# Altium schematic sheet DAC_FMC_connector.SchDoc: FMC DAC 1.5GS 4CH
size 420 x 297 mm; Author: G.Kasprowicz; CompanyName: WUT ISE; DrawnBy: G.Kasprowicz; Organization: WUT ISE; Address1: PW ISE; Address2: Nowowiejska 15/19 00-665 Warsaw; Address3: gkasprow@gmail.com; Revision: 1; SheetNumber: -; SheetTotal: -; ModifiedBy: -; CheckedDate: -; Title2: FMC; DivGrp: WUT ISE; Designer: G.Kasprowicz; ModifiedDate: -; ProjectName: Sensor Box
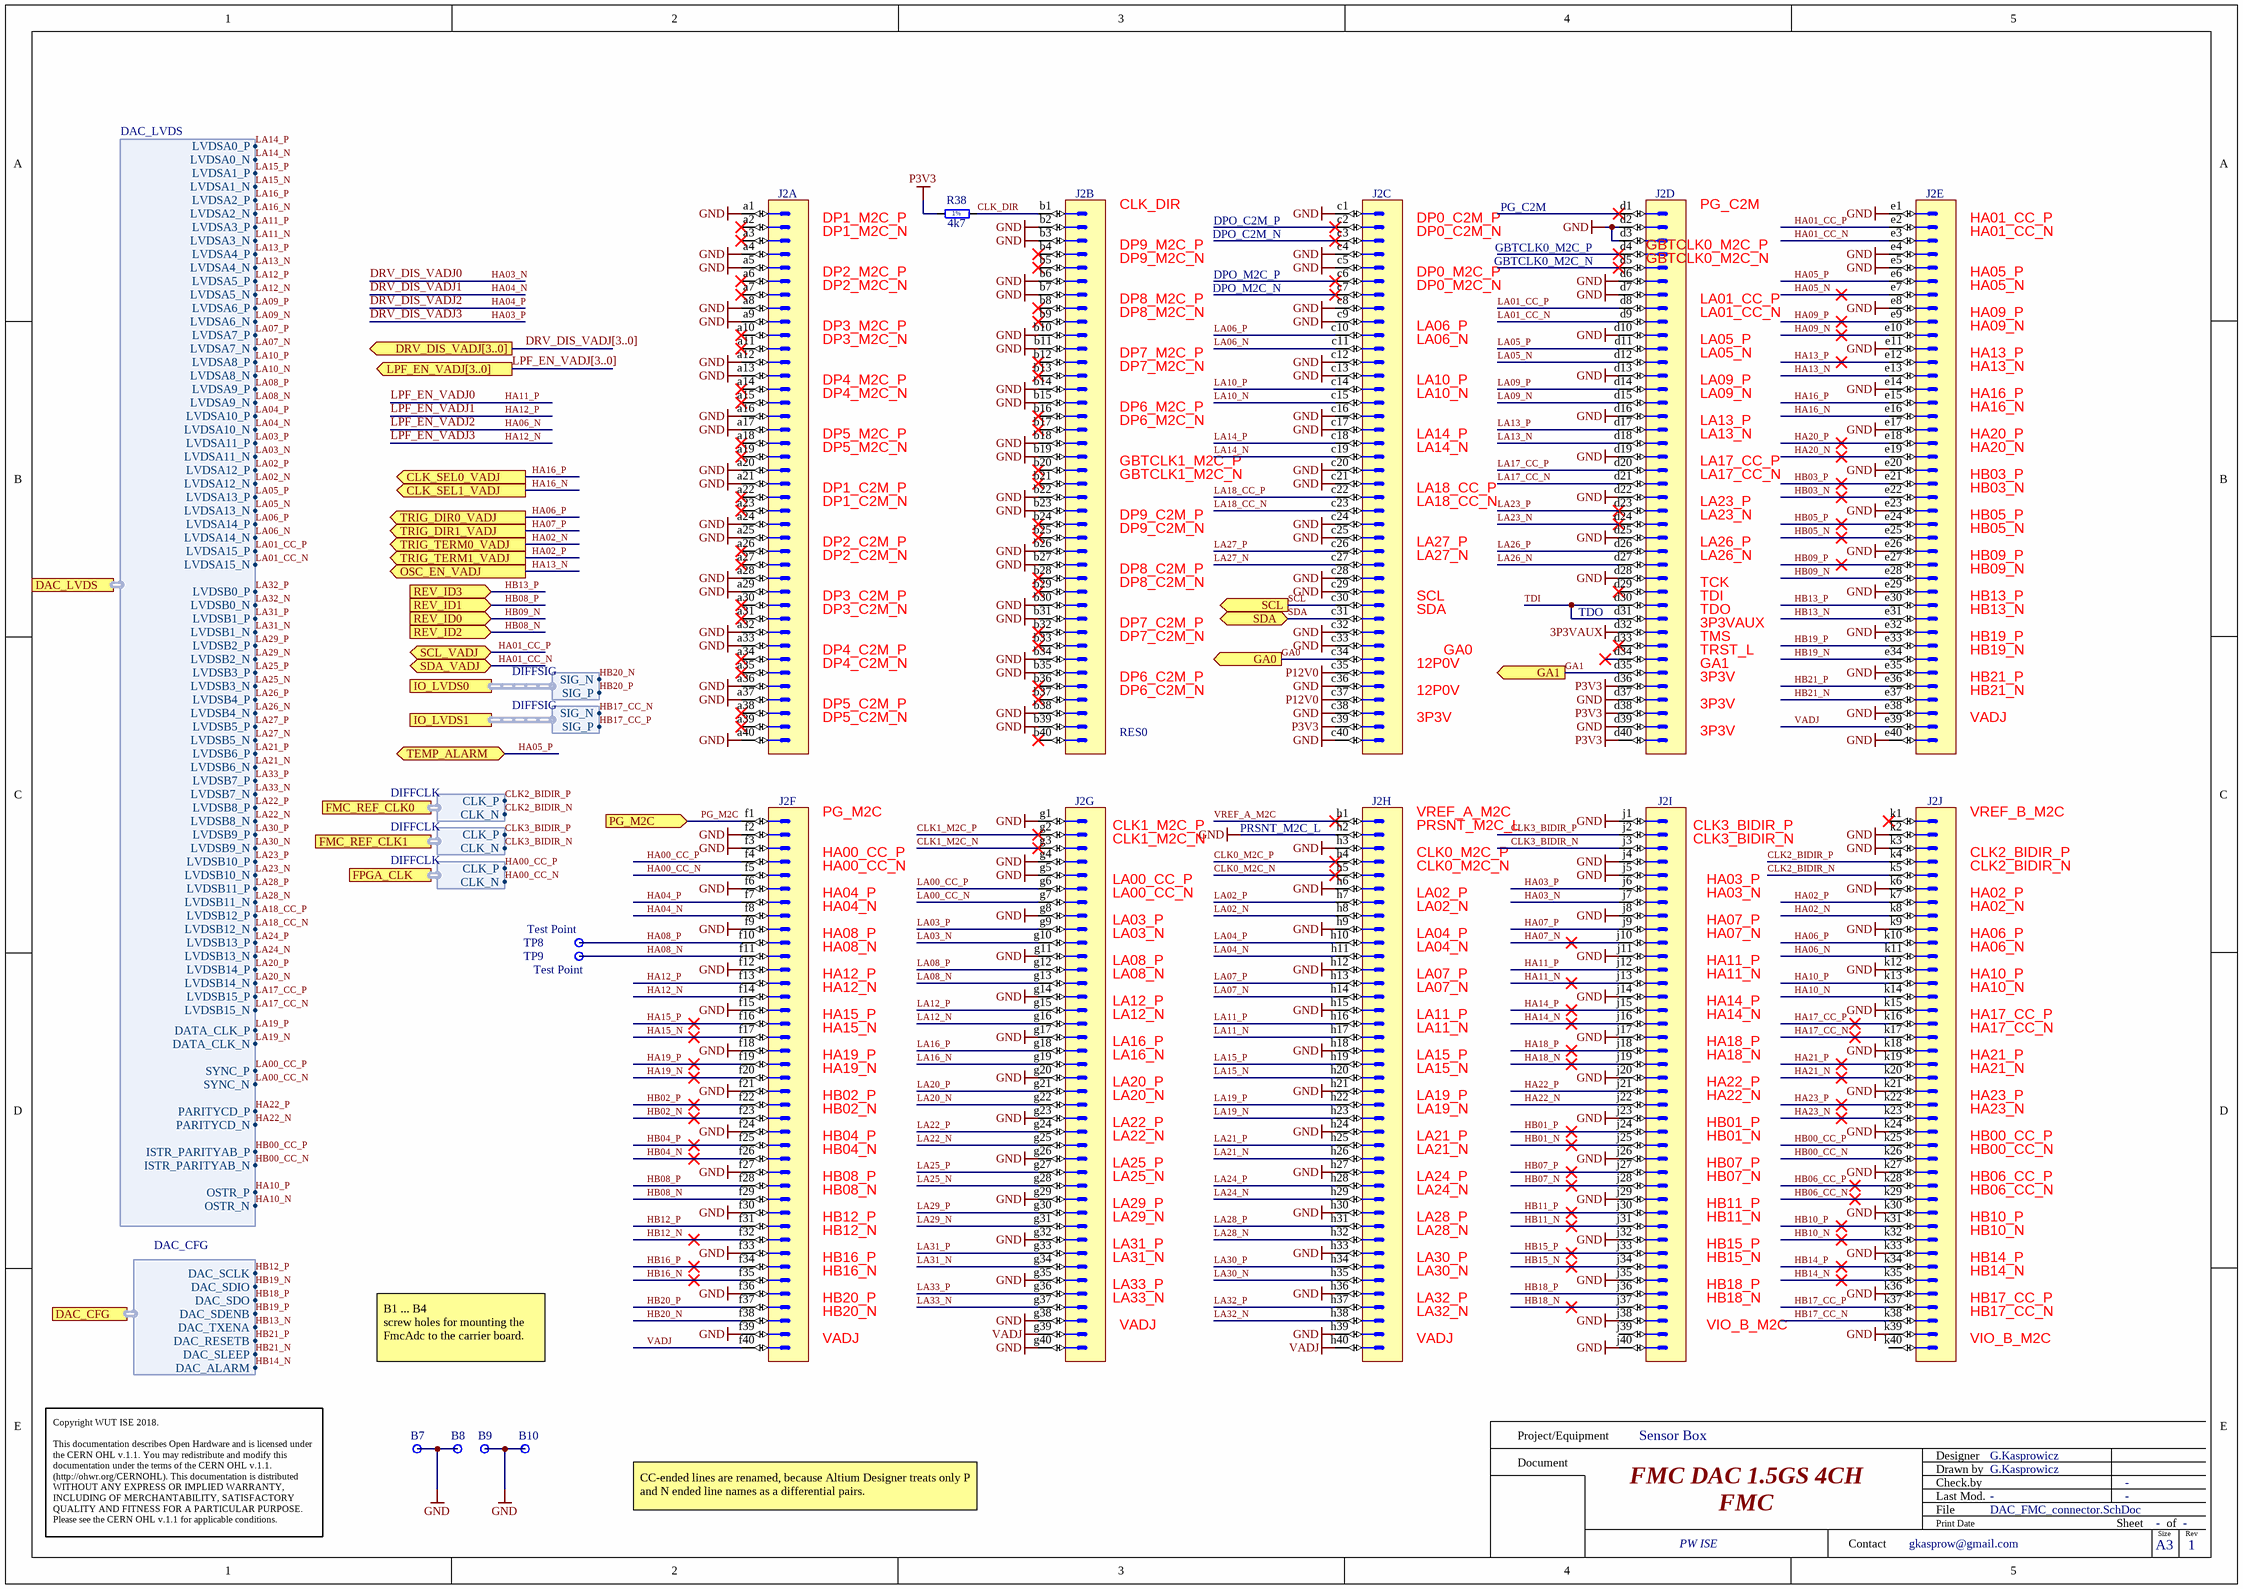
[diagram p0: DAC_FMC_connector.SchDoc]

## Parts
B7  Plated Hole  [MTG300_600]  (value not drawn)  (no BOM)
B8  Plated Hole  [MTG300_600]  (value not drawn)  (no BOM)
B9  Plated Hole  [MTG300_600]  (value not drawn)  (no BOM)
B10  Plated Hole  [MTG300_600]  (value not drawn)  (no BOM)
J2  VITA 57  [SAMTEC_ASP-134488-01]  (value not drawn)  (parts A,B,C,D,E,F,G,H,I,J of 10)
R38  4k7  [RESC1608X55N]
TP8  Test Point  [TPS127]  (no BOM)
TP9  Test Point  [TPS127]  (no BOM)

## Ports
CLK_SEL0_VADJ (out), CLK_SEL1_VADJ (out), DAC_CFG (harness DAC_CFG), DAC_LVDS (harness DAC_LVDS), DRV_DIS_VADJ[3..0] (out), FMC_REF_CLK0 (harness DIFFCLK), FMC_REF_CLK1 (harness DIFFCLK), FPGA_CLK (harness DIFFCLK), GA0 (out), GA1 (out), IO_LVDS0 (harness DIFFSIG), IO_LVDS1 (harness DIFFSIG), LPF_EN_VADJ[3..0] (out), OSC_EN_VADJ (out), PG_M2C (in), REV_ID0 (in), REV_ID1 (in), REV_ID2 (in), REV_ID3 (in), SCL (out), SCL_VADJ (bidir), SDA (bidir), SDA_VADJ (bidir), TEMP_ALARM (bidir), TRIG_DIR0_VADJ (out), TRIG_DIR1_VADJ (out), TRIG_TERM0_VADJ (out), TRIG_TERM1_VADJ (out)

## Harnesses
DAC_LVDS: LVDSA0_P, LVDSA0_N, LVDSA1_P, LVDSA1_N, LVDSA2_P, LVDSA2_N, LVDSA3_P, LVDSA3_N, LVDSA4_P, LVDSA4_N, LVDSA5_P, LVDSA5_N, LVDSA6_P, LVDSA6_N, LVDSA7_P, LVDSA7_N, LVDSA8_P, LVDSA8_N, LVDSA9_P, LVDSA9_N, LVDSA10_P, LVDSA10_N, LVDSA11_P, LVDSA11_N, LVDSA12_P, LVDSA12_N, LVDSA13_P, LVDSA13_N, LVDSA14_P, LVDSA14_N, LVDSA15_P, LVDSA15_N, LVDSB0_P, LVDSB0_N, LVDSB1_P, LVDSB1_N, LVDSB2_P, LVDSB2_N, LVDSB3_P, LVDSB3_N, LVDSB4_P, LVDSB4_N, LVDSB5_P, LVDSB5_N, LVDSB6_P, LVDSB6_N, LVDSB7_P, LVDSB7_N, LVDSB8_P, LVDSB8_N, LVDSB9_P, LVDSB9_N, LVDSB10_P, LVDSB10_N, LVDSB11_P, LVDSB11_N, LVDSB12_P, LVDSB12_N, LVDSB13_P, LVDSB13_N, LVDSB14_P, LVDSB14_N, LVDSB15_P, LVDSB15_N, DATA_CLK_P, DATA_CLK_N, SYNC_P, SYNC_N, PARITYCD_P, PARITYCD_N, ISTR_PARITYAB_P, ISTR_PARITYAB_N, OSTR_P, OSTR_N
DAC_CFG: DAC_SCLK, DAC_SDIO, DAC_SDO, DAC_SDENB, DAC_TXENA, DAC_RESETB, DAC_SLEEP, DAC_ALARM
DIFFCLK: CLK_P, CLK_N
DIFFSIG: SIG_N, SIG_P

## Nets
3P3VAUX: J2.d32
GND: B7.1 B8.1 B9.1 B10.1 J2.a1 J2.a4 J2.a5 J2.a8 J2.a9 J2.a12 J2.a13 J2.a16 J2.a17 J2.a20 J2.a21 J2.a24 J2.a25 J2.a28 J2.a29 J2.a32 J2.a33 J2.a36 J2.a37 J2.a40 J2.b2 J2.b3 J2.b6 J2.b7 J2.b10 J2.b11 J2.b14 J2.b15 J2.b18 J2.b19 J2.b22 J2.b23 J2.b26 J2.b27 J2.b30 J2.b31 J2.b34 J2.b35 J2.b38 J2.b39 J2.c1 J2.c4 J2.c5 J2.c8 J2.c9 J2.c12 J2.c13 J2.c16 J2.c17 J2.c20 J2.c21 J2.c24 J2.c25 J2.c28 J2.c29 J2.c32 J2.c33 J2.c36 J2.c38 J2.c40 J2.d2 J2.d3 J2.d6 J2.d7 J2.d10 J2.d13 J2.d16 J2.d19 J2.d22 J2.d25 J2.d28 J2.d37 J2.d39 J2.e1 J2.e4 J2.e5 J2.e8 J2.e11 J2.e14 J2.e17 J2.e20 J2.e23 J2.e26 J2.e29 J2.e32 J2.e35 J2.e38 J2.e40 J2.f2 J2.f3 J2.f6 J2.f9 J2.f12 J2.f15 J2.f18 J2.f21 J2.f24 J2.f27 J2.f30 J2.f33 J2.f36 J2.f39 J2.g1 J2.g4 J2.g5 J2.g8 J2.g11 J2.g14 J2.g17 J2.g20 J2.g23 J2.g26 J2.g29 J2.g32 J2.g35 J2.g38 J2.g40 J2.h2 J2.h3 J2.h6 J2.h9 J2.h12 J2.h15 J2.h18 J2.h21 J2.h24 J2.h27 J2.h30 J2.h33 J2.h36 J2.h39 J2.j1 J2.j4 J2.j5 J2.j8 J2.j11 J2.j14 J2.j17 J2.j20 J2.j23 J2.j26 J2.j29 J2.j32 J2.j35 J2.j38 J2.j40 J2.k2 J2.k3 J2.k6 J2.k9 J2.k12 J2.k15 J2.k18 J2.k21 J2.k24 J2.k27 J2.k30 J2.k33 J2.k36 J2.k39
P3V3: J2.c39 J2.d36 J2.d38 J2.d40 R38.1
P12V0: J2.c35 J2.c37
VADJ: J2.e39 J2.f40 J2.g39 J2.h40
CLK0_M2C_N: J2.h5
CLK0_M2C_P: J2.h4
CLK1_M2C_N: J2.g3
CLK1_M2C_P: J2.g2
CLK2_BIDIR_N: J2.k5 ; port FMC_REF_CLK0.CLK_N
CLK2_BIDIR_P: J2.k4 ; port FMC_REF_CLK0.CLK_P
CLK3_BIDIR_N: J2.j3 ; port FMC_REF_CLK1.CLK_N
CLK3_BIDIR_P: J2.j2 ; port FMC_REF_CLK1.CLK_P
CLK_DIR: J2.b1 R38.2
DRV_DIS_VADJ0: J2.j7  [also labelled HA03_N]
DRV_DIS_VADJ1: J2.f8  [also labelled HA04_N]
DRV_DIS_VADJ2: J2.f7  [also labelled HA04_P]
DRV_DIS_VADJ3: J2.j6  [also labelled HA03_P]
GA0: J2.c34 ; port GA0
GA1: J2.d35 ; port GA1
HA00_CC_N: J2.f5 ; port FPGA_CLK.CLK_N
HA00_CC_P: J2.f4 ; port FPGA_CLK.CLK_P
HA01_CC_N: J2.e3 ; port SDA_VADJ
HA01_CC_P: J2.e2 ; port SCL_VADJ
HA02_N: J2.k8 ; port TRIG_TERM0_VADJ
HA02_P: J2.k7 ; port TRIG_TERM1_VADJ
HA05_N: J2.e7
HA05_P: J2.e6 ; port TEMP_ALARM
HA06_N: J2.k11  [also labelled LPF_EN_VADJ2]
HA06_P: J2.k10 ; port TRIG_DIR0_VADJ
HA07_N: J2.j10
HA07_P: J2.j9 ; port TRIG_DIR1_VADJ
HA08_N: J2.f11 TP9.1
HA08_P: J2.f10 TP8.1
HA09_N: J2.e10
HA09_P: J2.e9
HA10_N: J2.k14 ; port DAC_LVDS.OSTR_N
HA10_P: J2.k13 ; port DAC_LVDS.OSTR_P
HA11_N: J2.j13
HA11_P: J2.j12  [also labelled LPF_EN_VADJ0]
HA12_N: J2.f14  [also labelled LPF_EN_VADJ3]
HA12_P: J2.f13  [also labelled LPF_EN_VADJ1]
HA13_N: J2.e13 ; port OSC_EN_VADJ
HA13_P: J2.e12
HA14_N: J2.j16
HA14_P: J2.j15
HA15_N: J2.f17
HA15_P: J2.f16
HA16_N: J2.e16 ; port CLK_SEL1_VADJ
HA16_P: J2.e15 ; port CLK_SEL0_VADJ
HA17_CC_N: J2.k17
HA17_CC_P: J2.k16
HA18_N: J2.j19
HA18_P: J2.j18
HA19_N: J2.f20
HA19_P: J2.f19
HA20_N: J2.e19
HA20_P: J2.e18
HA21_N: J2.k20
HA21_P: J2.k19
HA22_N: J2.j22 ; port DAC_LVDS.PARITYCD_N
HA22_P: J2.j21 ; port DAC_LVDS.PARITYCD_P
HA23_N: J2.k23
HA23_P: J2.k22
HB00_CC_N: J2.k26 ; port DAC_LVDS.ISTR_PARITYAB_N
HB00_CC_P: J2.k25 ; port DAC_LVDS.ISTR_PARITYAB_P
HB01_N: J2.j25
HB01_P: J2.j24
HB02_N: J2.f23
HB02_P: J2.f22
HB03_N: J2.e22
HB03_P: J2.e21
HB04_N: J2.f26
HB04_P: J2.f25
HB05_N: J2.e25
HB05_P: J2.e24
HB06_CC_N: J2.k29
HB06_CC_P: J2.k28
HB07_N: J2.j28
HB07_P: J2.j27
HB08_N: J2.f29 ; port REV_ID2
HB08_P: J2.f28 ; port REV_ID1
HB09_N: J2.e28 ; port REV_ID0
HB09_P: J2.e27
HB10_N: J2.k32
HB10_P: J2.k31
HB11_N: J2.j31
HB11_P: J2.j30
HB12_N: J2.f32
HB12_P: J2.f31 ; port DAC_CFG.DAC_SCLK
HB13_N: J2.e31 ; port DAC_CFG.DAC_TXENA
HB13_P: J2.e30 ; port REV_ID3
HB14_N: J2.k35 ; port DAC_CFG.DAC_ALARM
HB14_P: J2.k34
HB15_N: J2.j34
HB15_P: J2.j33
HB16_N: J2.f35
HB16_P: J2.f34
HB17_CC_N: J2.k38 ; port IO_LVDS1.SIG_N
HB17_CC_P: J2.k37 ; port IO_LVDS1.SIG_P
HB18_N: J2.j37
HB18_P: J2.j36 ; port DAC_CFG.DAC_SDO
HB19_N: J2.e34 ; port DAC_CFG.DAC_SDIO
HB19_P: J2.e33 ; port DAC_CFG.DAC_SDENB
HB20_N: J2.f38 ; port IO_LVDS0.SIG_N
HB20_P: J2.f37 ; port IO_LVDS0.SIG_P
HB21_N: J2.e37 ; port DAC_CFG.DAC_SLEEP
HB21_P: J2.e36 ; port DAC_CFG.DAC_RESETB
LA00_CC_N: J2.g7 ; port DAC_LVDS.SYNC_N
LA00_CC_P: J2.g6 ; port DAC_LVDS.SYNC_P
LA01_CC_N: J2.d9 ; port DAC_LVDS.LVDSA15_N
LA01_CC_P: J2.d8 ; port DAC_LVDS.LVDSA15_P
LA02_N: J2.h8 ; port DAC_LVDS.LVDSA12_N
LA02_P: J2.h7 ; port DAC_LVDS.LVDSA12_P
LA03_N: J2.g10 ; port DAC_LVDS.LVDSA11_N
LA03_P: J2.g9 ; port DAC_LVDS.LVDSA11_P
LA04_N: J2.h11 ; port DAC_LVDS.LVDSA10_N
LA04_P: J2.h10 ; port DAC_LVDS.LVDSA10_P
LA05_N: J2.d12 ; port DAC_LVDS.LVDSA13_N
LA05_P: J2.d11 ; port DAC_LVDS.LVDSA13_P
LA06_N: J2.c11 ; port DAC_LVDS.LVDSA14_N
LA06_P: J2.c10 ; port DAC_LVDS.LVDSA14_P
LA07_N: J2.h14 ; port DAC_LVDS.LVDSA7_N
LA07_P: J2.h13 ; port DAC_LVDS.LVDSA7_P
LA08_N: J2.g13 ; port DAC_LVDS.LVDSA9_N
LA08_P: J2.g12 ; port DAC_LVDS.LVDSA9_P
LA09_N: J2.d15 ; port DAC_LVDS.LVDSA6_N
LA09_P: J2.d14 ; port DAC_LVDS.LVDSA6_P
LA10_N: J2.c15 ; port DAC_LVDS.LVDSA8_N
LA10_P: J2.c14 ; port DAC_LVDS.LVDSA8_P
LA11_N: J2.h17 ; port DAC_LVDS.LVDSA3_N
LA11_P: J2.h16 ; port DAC_LVDS.LVDSA3_P
LA12_N: J2.g16 ; port DAC_LVDS.LVDSA5_N
LA12_P: J2.g15 ; port DAC_LVDS.LVDSA5_P
LA13_N: J2.d18 ; port DAC_LVDS.LVDSA4_N
LA13_P: J2.d17 ; port DAC_LVDS.LVDSA4_P
LA14_N: J2.c19 ; port DAC_LVDS.LVDSA0_N
LA14_P: J2.c18 ; port DAC_LVDS.LVDSA0_P
LA15_N: J2.h20 ; port DAC_LVDS.LVDSA1_N
LA15_P: J2.h19 ; port DAC_LVDS.LVDSA1_P
LA16_N: J2.g19 ; port DAC_LVDS.LVDSA2_N
LA16_P: J2.g18 ; port DAC_LVDS.LVDSA2_P
LA17_CC_N: J2.d21 ; port DAC_LVDS.LVDSB15_N
LA17_CC_P: J2.d20 ; port DAC_LVDS.LVDSB15_P
LA18_CC_N: J2.c23 ; port DAC_LVDS.LVDSB12_N
LA18_CC_P: J2.c22 ; port DAC_LVDS.LVDSB12_P
LA19_N: J2.h23 ; port DAC_LVDS.DATA_CLK_N
LA19_P: J2.h22 ; port DAC_LVDS.DATA_CLK_P
LA20_N: J2.g22 ; port DAC_LVDS.LVDSB14_N
LA20_P: J2.g21 ; port DAC_LVDS.LVDSB14_P
LA21_N: J2.h26 ; port DAC_LVDS.LVDSB6_N
LA21_P: J2.h25 ; port DAC_LVDS.LVDSB6_P
LA22_N: J2.g25 ; port DAC_LVDS.LVDSB8_N
LA22_P: J2.g24 ; port DAC_LVDS.LVDSB8_P
LA23_N: J2.d24 ; port DAC_LVDS.LVDSB10_N
LA23_P: J2.d23 ; port DAC_LVDS.LVDSB10_P
LA24_N: J2.h29 ; port DAC_LVDS.LVDSB13_N
LA24_P: J2.h28 ; port DAC_LVDS.LVDSB13_P
LA25_N: J2.g28 ; port DAC_LVDS.LVDSB3_N
LA25_P: J2.g27 ; port DAC_LVDS.LVDSB3_P
LA26_N: J2.d27 ; port DAC_LVDS.LVDSB4_N
LA26_P: J2.d26 ; port DAC_LVDS.LVDSB4_P
LA27_N: J2.c27 ; port DAC_LVDS.LVDSB5_N
LA27_P: J2.c26 ; port DAC_LVDS.LVDSB5_P
LA28_N: J2.h32 ; port DAC_LVDS.LVDSB11_N
LA28_P: J2.h31 ; port DAC_LVDS.LVDSB11_P
LA29_N: J2.g31 ; port DAC_LVDS.LVDSB2_N
LA29_P: J2.g30 ; port DAC_LVDS.LVDSB2_P
LA30_N: J2.h35 ; port DAC_LVDS.LVDSB9_N
LA30_P: J2.h34 ; port DAC_LVDS.LVDSB9_P
LA31_N: J2.g34 ; port DAC_LVDS.LVDSB1_N
LA31_P: J2.g33 ; port DAC_LVDS.LVDSB1_P
LA32_N: J2.h38 ; port DAC_LVDS.LVDSB0_N
LA32_P: J2.h37 ; port DAC_LVDS.LVDSB0_P
LA33_N: J2.g37 ; port DAC_LVDS.LVDSB7_N
LA33_P: J2.g36 ; port DAC_LVDS.LVDSB7_P
PG_M2C: J2.f1 ; port PG_M2C
SCL: J2.c30 ; port SCL
SDA: J2.c31 ; port SDA
TDI: J2.d30 J2.d31
VREF_A_M2C: J2.h1

Not connected (* = marked no-connect by the designer): J2 a2* a3* a6* a7* a10* a11* a14* a15* a18* a19* a22* a23* a26* a27* a30* a31* a34* a35* a38* a39* b4* b5* b8* b9* b12* b13* b16* b17* b20* b21* b24* b25* b28* b29* b32* b33* b36* b37* b40* c2* c3* c6* c7* d1* d4* d5* d29* d33* d34* j39 k1* k40

## Buses and harness runs
bus DRV_DIS_VADJ[3..0] = port DRV_DIS_VADJ[3..0]
bus LPF_EN_VADJ[3..0] = port LPF_EN_VADJ[3..0]

## Notes on the sheet
- DP1_M2C_P
- DP1_M2C_N
- CLK_DIR
- DP9_M2C_P
- DP9_M2C_N
- DPO_C2M_P
- DPO_C2M_N
- DP0_C2M_P
- DP0_C2M_N
- PG_C2M
- GBTCLK0_M2C_P
- GBTCLK0_M2C_N
- (near J2) GBTCLK0_M2C_P
- (near J2) GBTCLK0_M2C_N
- HA01_CC_P
- HA01_CC_N
- DP2_M2C_P
- DP2_M2C_N
- DP8_M2C_P
- DP8_M2C_N
- DPO_M2C_P
- DPO_M2C_N
- DP0_M2C_P
- DP0_M2C_N
- LA01_CC_P
- LA01_CC_N
- HA05_P
- HA05_N
- HA09_P
- DP3_M2C_P
- DP3_M2C_N
- DP4_M2C_P
- DP4_M2C_N
- DP7_M2C_P
- DP7_M2C_N
- LA06_P
- LA06_N
- LA10_P
- LA10_N
- LA05_P
- LA05_N
- LA09_P
- LA09_N
- HA09_N
- HA13_P
- HA13_N
- HA16_P
- DP5_M2C_P
- DP5_M2C_N
- DP6_M2C_P
- DP6_M2C_N
- LA14_P
- LA14_N
- LA13_P
- LA13_N
- HA16_N
- HA20_P
- HA20_N
- DP1_C2M_P
- DP1_C2M_N
- GBTCLK1_M2C_P
- GBTCLK1_M2C_N
- DP9_C2M_P
- DP9_C2M_N
- LA18_CC_P
- LA18_CC_N
- LA17_CC_P
- LA17_CC_N
- LA23_P
- LA23_N
- HB03_P
- HB03_N
- HB05_P
- HB05_N
- DP2_C2M_P
- DP2_C2M_N
- DP8_C2M_P
- DP8_C2M_N
- LA27_P
- LA27_N
- LA26_P
- LA26_N
- TCK
- HB09_P
- HB09_N
- DP3_C2M_P
- DP3_C2M_N
- DP4_C2M_P
- DP4_C2M_N
- DP7_C2M_P
- DP7_C2M_N
- SCL
- SDA
- 12P0V
- GA0
- (near J2) TDO
- TDI
- TDO
- 3P3VAUX
- TMS
- TRST_L
- GA1
- HB13_P
- HB13_N
- HB19_P
- HB19_N
- DP5_C2M_P
- DP5_C2M_N
- DP6_C2M_P
- DP6_C2M_N
- 3P3V
- HB21_P
- HB21_N
- VADJ
- RES0
- PG_M2C
- HA00_CC_P
- (near J2) CLK1_M2C_P
- (near J2) CLK1_M2C_N
- (near J2) PRSNT_M2C_L
- VREF_A_M2C
- PRSNT_M2C_L
- CLK0_M2C_P
- (near J2) CLK3_BIDIR_P
- (near J2) CLK3_BIDIR_N
- VREF_B_M2C
- CLK2_BIDIR_P
- HA00_CC_N
- HA04_P
- HA04_N
- HA08_P
- (near J2) LA00_CC_P
- (near J2) LA00_CC_N
- (near J2) LA03_P
- (near J2) LA03_N
- CLK0_M2C_N
- LA02_P
- LA02_N
- LA04_P
- HA03_P
- HA03_N
- HA07_P
- HA07_N
- CLK2_BIDIR_N
- HA02_P
- HA02_N
- HA06_P
- HA08_N
- HA12_P
- HA12_N
- (near J2) LA08_P
- (near J2) LA08_N
- LA04_N
- LA07_P
- LA07_N
- HA11_P
- HA11_N
- HA06_N
- HA10_P
- HA10_N
- HA15_P
- HA15_N
- HA19_P
- HA19_N
- (near J2) LA12_P
- (near J2) LA12_N
- (near J2) LA16_P
- (near J2) LA16_N
- LA11_P
- LA11_N
- LA15_P
- LA15_N
- HA14_P
- HA14_N
- HA18_P
- HA18_N
- HA17_CC_P
- HA17_CC_N
- HA21_P
- HA21_N
- HB02_P
- HB02_N
- (near J2) LA20_P
- (near J2) LA20_N
- (near J2) LA22_P
- LA19_P
- LA19_N
- HA22_P
- HA22_N
- HB01_P
- HA23_P
- HA23_N
- HB04_P
- HB04_N
- HB08_P
- HB08_N
- (near J2) LA22_N
- (near J2) LA25_P
- (near J2) LA25_N
- (near J2) LA29_P
- LA21_P
- LA21_N
- LA24_P
- LA24_N
- HB01_N
- HB07_P
- HB07_N
- HB11_P
- HB00_CC_P
- HB00_CC_N
- HB06_CC_P
- HB06_CC_N
- HB12_P
- HB12_N
- HB16_P
- (near J2) LA29_N
- (near J2) LA31_P
- (near J2) LA31_N
- LA28_P
- LA28_N
- LA30_P
- HB11_N
- HB15_P
- HB15_N
- HB10_P
- HB10_N
- HB14_P
- HB16_N
- HB20_P
- HB20_N
- (near J2) LA33_P
- (near J2) LA33_N
- LA30_N
- LA32_P
- LA32_N
- HB18_P
- HB18_N
- VIO_B_M2C
- HB14_N
- HB17_CC_P
- HB17_CC_N
- B1 ... B4
  screw holes for mounting the FmcAdc to the carrier board.
- CC-ended lines are renamed, because Altium Designer treats only P and N ended line names as a differential pairs.
- Project/Equipment
- Document
- Designer
- Drawn by
- Check.by
- Copyright WUT ISE 2018.
  This documentation describes Open Hardware and is licensed under the CERN OHL v.1.1. You may redistribute and modify this documentation under the terms of the CERN OHL v.1.1. (http://ohwr.org/CERNOHL). This documentation is distributed WITHOUT ANY EXPRESS OR IMPLIED WARRANTY, INCLUDING OF MERCHANTABILITY, SATISFACTORY QUALITY AND FITNESS FOR A PARTICULAR PURPOSE. Please see the CERN OHL v.1.1 for applicable conditions.
- Contact
- File
- Last Mod.
- Print Date
- Sheet
- Size
- A3
- of
- Rev
- (in symbol R0603_4K7_1%_0.1W_100PPM) 1%

## Library data of the parts
B7-B10 = PLATED_HOLE3.0_PAD6.0: Single Terminal Socket; Part Description: Plated Through Hole: Hole Dia.=3.0mm Pad Dia.=6.0mm; Mounted: No; Table: Pads; Part Number: PLATED_HOLE3.0_PAD6.0; Component Type: Standard (No BOM); Designator: Single Terminal Socket; Library Reference: Single Terminal Socket; Pin Count: 1; Family: Plated Hole; Socket: No; SMD: No; Status: None; ComponentHeight: 0mm; Author: CERN DEM JLC; CreateDate: 26.05.2008; LatestRevisionDate: 26.05.2008; PackageDescription: Plated Through Hole: Hole Dia.=3.0mm Pad Dia.=6.0mm
J2 = SAMTEC_ASP-134488-01: Connector VITA 57, 400 Male contacts in 10 row abcdefghj; Part Description: 400 contacts (10 rows abcdefghj) Surface Mount Male Connector, VITA 57 (MC-HPC-10); Manufacturer: SAMTEC; Part Number: SAMTEC_ASP-134488-01; Component Kind: Standard; Component Type: Standard; Pin Count: 400; Family: VITA 57; Mounted: Yes; Socket: No; SMD: Yes; Status: None; Manufacturer Part Number: ASP-134488-01; ComponentHeight: 6.1mm; HelpURL: \\cern.ch\dfs\Applications\Altium\Datasheets\SAMTEC_ASP-134488-01.pdf; Author: CERN DEM JLC; CreateDate: 30/04/2009; LatestRevisionDate: 17/08/2009; Table: SAMTEC
R38 = R0603_4K7_1%_0.1W_100PPM: Resistor - 1%; Part Description: General Purpose Thick Film Chip Resistor; Manufacturer: GENERIC; Manufacturer1 Part Number: NRC06F4701TRF; Power: 0.1W; TC: ±100ppm/°C; Table: Resistors SMD; Part Number: R0603_4K7_1%_0.1W_100PPM; Component Kind: Standard; Component Type: Standard; Pin Count: 2; Value: 4k7; Status: Preferred; Tolerance: ±1%; Manufacturer Part Number: R0603_4K7_1%_0.1W_100PPM; Case: 0603; Mounted: Yes; Socket: No; SMD: Yes; Manufacturer1 Example: NIC COMPONENT; Manufacturer1 ComponentHeight: 0.55mm; HelpURL: \\cern.ch\dfs\Applications\Altium\Datasheets\R0603_NIC_NRC.pdf; Author: CERN DEM JLC; CreateDate: 03/12/2007; LatestRevisionDate: 13/03/2008
TP8 TP9 = SMD_PAD_1.27X1.27MM: Part Description: 1.27mm x 1.27mm PCB Copper Area (SMD Test Point); Mounted: No; Part Number: SMD_PAD_1.27X1.27MM; Component Type: Standard (No BOM); Pin Count: 1; Family: Test Point; Socket: No; SMD: Yes; Sense: No; Status: None; ComponentHeight: 0mm; HelpURL: Undefined; Author: CERN DEM JLC; CreateDate: 12.01.2008; LatestRevisionDate: 12.01.2008; PackageDescription: 1.27mm x 1.27mm PCB Copper Area (SMD Test Point)